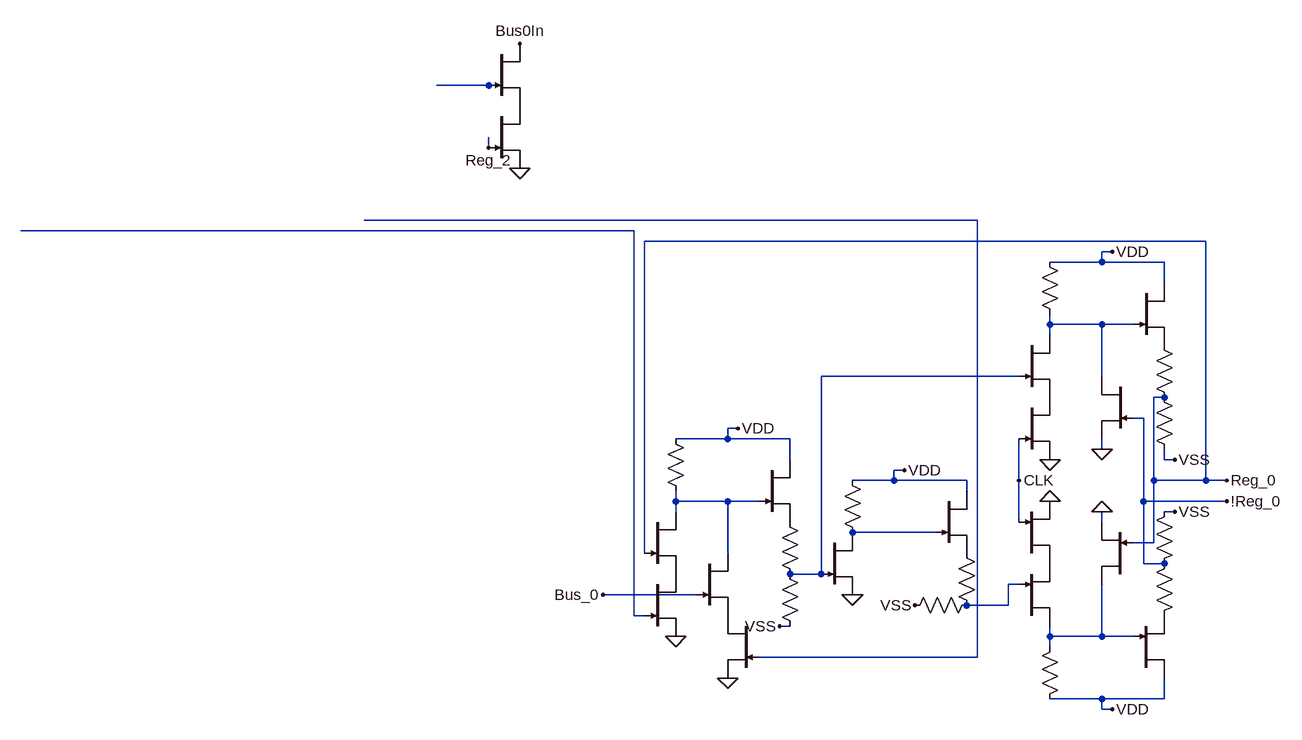
[diagram p0: schematic register 3 bit.asc]
register 3 bit.asc, the LTspice schematic file:
Version 4.1
SHEET 1 109444 42780
WIRE -4016 -1024 -4096 -1024
WIRE -4000 -1024 -4016 -1024
WIRE -4016 -928 -4016 -944
WIRE -3264 -816 -4208 -816
WIRE -3792 -800 -4736 -800
WIRE -2912 -784 -3776 -784
WIRE -3056 -768 -3072 -768
WIRE -3072 -752 -3072 -768
WIRE -3072 -752 -3152 -752
WIRE -2976 -752 -3072 -752
WIRE -2976 -720 -2976 -752
WIRE -3152 -656 -3152 -672
WIRE -3072 -656 -3152 -656
WIRE -3024 -656 -3072 -656
WIRE -3152 -640 -3152 -656
WIRE -3200 -576 -3504 -576
WIRE -3072 -576 -3072 -656
WIRE -2976 -544 -2992 -544
WIRE -3008 -512 -3024 -512
WIRE -3632 -496 -3648 -496
WIRE -3648 -480 -3648 -496
WIRE -3648 -480 -3728 -480
WIRE -3552 -480 -3648 -480
WIRE -3072 -464 -3072 -480
WIRE -3552 -448 -3552 -480
WIRE -2976 -448 -2976 -464
WIRE -2960 -448 -2976 -448
WIRE -3376 -432 -3392 -432
WIRE -3392 -416 -3392 -432
WIRE -3392 -416 -3456 -416
WIRE -3280 -416 -3392 -416
WIRE -3200 -416 -3200 -480
WIRE -2992 -416 -2992 -544
WIRE -2912 -416 -2912 -784
WIRE -2912 -416 -2992 -416
WIRE -2880 -416 -2912 -416
WIRE -3280 -400 -3280 -416
WIRE -3728 -384 -3728 -400
WIRE -3648 -384 -3728 -384
WIRE -3600 -384 -3648 -384
WIRE -3008 -384 -3008 -512
WIRE -2880 -384 -3008 -384
WIRE -3728 -368 -3728 -384
WIRE -2960 -368 -2976 -368
WIRE -3200 -352 -3200 -416
WIRE -3072 -352 -3072 -368
WIRE -3328 -336 -3456 -336
WIRE -2992 -320 -2992 -416
WIRE -2992 -320 -3024 -320
WIRE -3776 -304 -3776 -784
WIRE -3648 -304 -3648 -384
WIRE -3008 -288 -3008 -384
WIRE -2976 -288 -3008 -288
WIRE -3504 -272 -3504 -576
WIRE -3504 -272 -3552 -272
WIRE -3200 -256 -3216 -256
WIRE -3696 -240 -3840 -240
WIRE -3216 -224 -3216 -256
WIRE -3216 -224 -3280 -224
WIRE -3792 -208 -3792 -800
WIRE -3776 -208 -3792 -208
WIRE -3552 -192 -3568 -192
WIRE -3152 -176 -3152 -192
WIRE -3072 -176 -3072 -256
WIRE -3072 -176 -3152 -176
WIRE -3024 -176 -3072 -176
WIRE -3152 -160 -3152 -176
WIRE -3264 -144 -3264 -816
WIRE -3264 -144 -3600 -144
WIRE -3072 -80 -3152 -80
WIRE -2976 -80 -2976 -112
WIRE -2976 -80 -3072 -80
WIRE -3072 -64 -3072 -80
WIRE -3056 -64 -3072 -64
FLAG -3056 -768 VDD
FLAG -3056 -64 VDD
FLAG -2960 -368 VSS
FLAG -3152 -384 0
FLAG -3152 -448 0
FLAG -3072 -464 0
FLAG -3072 -368 0
FLAG -2960 -448 VSS
FLAG -3200 -416 CLK
FLAG -3648 -112 0
FLAG -3728 -176 0
FLAG -3456 -240 0
FLAG -3632 -496 VDD
FLAG -3376 -432 VDD
FLAG -3568 -192 VSS
FLAG -3360 -224 VSS
FLAG -3840 -240 Bus_0
FLAG -2880 -416 Reg_0
FLAG -2880 -384 !Reg_0
FLAG -3968 -896 0
FLAG -3968 -1088 Bus0In
FLAG -4016 -928 Reg_2
SYMBOL njf -3200 -640 R0
WINDOW 0 56 32 Invisible 2
WINDOW 3 56 72 Invisible 2
SYMATTR InstName J_A9
SYMATTR Value DR
SYMBOL res -3168 -768 R0
WINDOW 0 -35 57 Invisible 2
WINDOW 3 34 56 Invisible 2
SYMATTR InstName R13
SYMATTR Value 100k
SYMBOL njf -3024 -720 R0
WINDOW 0 56 32 Invisible 2
WINDOW 3 56 72 Invisible 2
SYMATTR InstName J_F4
SYMATTR Value DR
SYMBOL res -2992 -640 R0
WINDOW 0 -24 60 Invisible 2
WINDOW 3 34 58 Invisible 2
SYMATTR InstName R14
SYMATTR Value 1k
SYMBOL res -2992 -560 R0
WINDOW 0 -22 62 Invisible 2
WINDOW 3 37 62 Invisible 2
SYMATTR InstName R15
SYMATTR Value 4.8k
SYMBOL njf -3024 -576 M0
WINDOW 0 11 -7 Invisible 2
WINDOW 3 56 72 Invisible 2
SYMATTR InstName J_B5
SYMATTR Value DR
SYMBOL njf -3200 -192 M180
WINDOW 0 56 32 Invisible 2
WINDOW 3 56 72 Invisible 2
SYMATTR InstName J_A10
SYMATTR Value DR
SYMBOL res -3168 -64 M180
WINDOW 0 36 76 Invisible 2
WINDOW 3 36 40 Invisible 2
SYMATTR InstName R16
SYMATTR Value 100k
SYMBOL njf -3024 -112 M180
WINDOW 0 56 32 Invisible 2
WINDOW 3 56 72 Invisible 2
SYMATTR InstName J_F5
SYMATTR Value DR
SYMBOL res -2992 -192 M180
WINDOW 0 36 76 Invisible 2
WINDOW 3 36 40 Invisible 2
SYMATTR InstName R17
SYMATTR Value 1k
SYMBOL res -2992 -272 M180
WINDOW 0 36 76 Invisible 2
WINDOW 3 36 40 Invisible 2
SYMATTR InstName R18
SYMATTR Value 4.8k
SYMBOL njf -3024 -256 R180
WINDOW 0 56 32 Invisible 2
WINDOW 3 56 72 Invisible 2
SYMATTR InstName J_B6
SYMATTR Value DR
SYMBOL njf -3200 -544 R0
WINDOW 0 56 32 Invisible 2
WINDOW 3 56 72 Invisible 2
SYMATTR InstName J_A11
SYMATTR Value DR
SYMBOL njf -3200 -288 M180
WINDOW 0 56 32 Invisible 2
WINDOW 3 56 72 Invisible 2
SYMATTR InstName J_A12
SYMATTR Value DR
SYMBOL njf -3776 -368 R0
WINDOW 0 56 32 Invisible 2
WINDOW 3 56 72 Invisible 2
SYMATTR InstName J_A13
SYMATTR Value DR
SYMBOL res -3744 -496 R0
WINDOW 0 -35 57 Invisible 2
WINDOW 3 34 56 Invisible 2
SYMATTR InstName R19
SYMATTR Value 100k
SYMBOL njf -3600 -448 R0
WINDOW 0 56 32 Invisible 2
WINDOW 3 56 72 Invisible 2
SYMATTR InstName J_F6
SYMATTR Value DR
SYMBOL res -3568 -368 R0
WINDOW 0 -24 60 Invisible 2
WINDOW 3 34 58 Invisible 2
SYMATTR InstName R20
SYMATTR Value 1k
SYMBOL res -3568 -288 R0
WINDOW 0 -22 62 Invisible 2
WINDOW 3 37 62 Invisible 2
SYMATTR InstName R21
SYMATTR Value 4.8k
SYMBOL njf -3696 -304 R0
WINDOW 0 56 32 Invisible 2
WINDOW 3 56 72 Invisible 2
SYMATTR InstName J_B7
SYMATTR Value DR
SYMBOL njf -3504 -336 R0
WINDOW 0 56 32 Invisible 2
WINDOW 3 56 72 Invisible 2
SYMATTR InstName J_A14
SYMATTR Value DR
SYMBOL res -3472 -432 R0
WINDOW 0 56 32 Invisible 2
WINDOW 3 56 72 Invisible 2
SYMATTR InstName R22
SYMATTR Value 50k
SYMBOL njf -3328 -400 R0
WINDOW 0 56 32 Invisible 2
WINDOW 3 56 72 Invisible 2
SYMATTR InstName J_A15
SYMATTR Value DR
SYMBOL res -3296 -320 R0
WINDOW 0 37 24 Invisible 2
WINDOW 3 -30 25 Invisible 2
SYMATTR InstName R23
SYMATTR Value 1k
SYMBOL res -3264 -240 R90
WINDOW 0 59 66 Invisible 2
WINDOW 3 34 13 Invisible 2
SYMATTR InstName R24
SYMATTR Value 4.5k
SYMBOL njf -3776 -272 R0
WINDOW 0 56 32 Invisible 2
WINDOW 3 56 72 Invisible 2
SYMATTR InstName J_A16
SYMATTR Value DR
SYMBOL njf -3600 -208 M0
WINDOW 0 56 32 Invisible 2
WINDOW 3 56 72 Invisible 2
SYMATTR InstName J_B8
SYMATTR Value DR
SYMBOL njf -4016 -992 R0
WINDOW 0 56 32 Invisible 2
WINDOW 3 56 72 Invisible 2
SYMATTR InstName J_A21
SYMATTR Value DR
SYMBOL njf -4016 -1088 R0
WINDOW 0 56 32 Invisible 2
WINDOW 3 56 72 Invisible 2
SYMATTR InstName J_A22
SYMATTR Value DR

The netlist it stands for:
* register 3 bit.asc
J_A9 N004 N005 P001 DR
R13 VDD N004 100k
J_F4 VDD N004 P002 DR
R14 P002 Reg_0 1k
R15 Reg_0 VSS 4.8k
J_B5 N004 !Reg_0 0 DR
J_A10 N009 N008 P003 DR
R16 VDD N009 100k
J_F5 VDD N009 P004 DR
R17 P004 !Reg_0 1k
R18 !Reg_0 VSS 4.8k
J_B6 N009 Reg_0 0 DR
J_A11 P001 CLK 0 DR
J_A12 P003 CLK 0 DR
J_A13 N006 Reg_0 P005 DR
R19 VDD N006 100k
J_F6 VDD N006 P006 DR
R20 P006 N005 1k
R21 N005 VSS 4.8k
J_B7 N006 Bus_0 P007 DR
J_A14 N007 N005 0 DR
R22 VDD N007 50k
J_A15 VDD N007 P008 DR
R23 P008 N008 1k
R24 N008 VSS 4.5k
J_A16 P005 N003 0 DR
J_B8 P007 N002 0 DR
J_A21 P009 Reg_2 0 DR
J_A22 Bus0In N001 P009 DR
.model NJF NJF
.model PJF PJF
.lib standard.jft
.backanno
.end